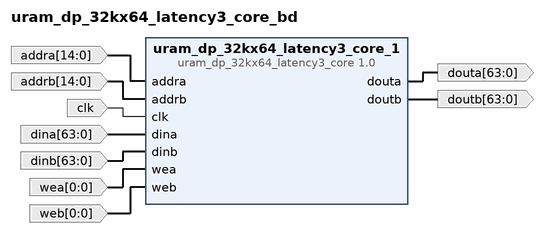
[diagram p0: block diagram of the top level]
# Vivado block design uram_dp_32kx64_latency3_core_bd, xcvu9p-flga2104-1-e, Vivado 2019.1.3
create_bd_design uram_dp_32kx64_latency3_core_bd

create_bd_port -dir I -from 14 -to 0 -type data addra
create_bd_port -dir I -from 14 -to 0 -type data addrb
create_bd_port -dir I -type clk clk
create_bd_port -dir I -from 63 -to 0 -type data dina
create_bd_port -dir I -from 63 -to 0 -type data dinb
create_bd_port -dir O -from 63 -to 0 -type data douta
create_bd_port -dir O -from 63 -to 0 -type data doutb
create_bd_port -dir I -from 0 -to 0 -type data wea
create_bd_port -dir I -from 0 -to 0 -type data web

create_bd_cell -type ip -vlnv User_Company:SysGen:uram_dp_32kx64_latency3_core:1.0 uram_dp_32kx64_latency3_core_1

# ---- connections ----

connect_bd_net [get_bd_ports addra] [get_bd_pins uram_dp_32kx64_latency3_core_1/addra]
connect_bd_net [get_bd_ports addrb] [get_bd_pins uram_dp_32kx64_latency3_core_1/addrb]
connect_bd_net [get_bd_ports clk] [get_bd_pins uram_dp_32kx64_latency3_core_1/clk]
connect_bd_net [get_bd_ports dina] [get_bd_pins uram_dp_32kx64_latency3_core_1/dina]
connect_bd_net [get_bd_ports dinb] [get_bd_pins uram_dp_32kx64_latency3_core_1/dinb]
connect_bd_net [get_bd_pins uram_dp_32kx64_latency3_core_1/douta] [get_bd_ports douta]
connect_bd_net [get_bd_pins uram_dp_32kx64_latency3_core_1/doutb] [get_bd_ports doutb]
connect_bd_net [get_bd_ports wea] [get_bd_pins uram_dp_32kx64_latency3_core_1/wea]
connect_bd_net [get_bd_ports web] [get_bd_pins uram_dp_32kx64_latency3_core_1/web]

validate_bd_design
save_bd_design
